# EasyEDA Pro project ProPrj_nrf52833_LighthouseTag_2025-07-26.epro, board PCB18_4
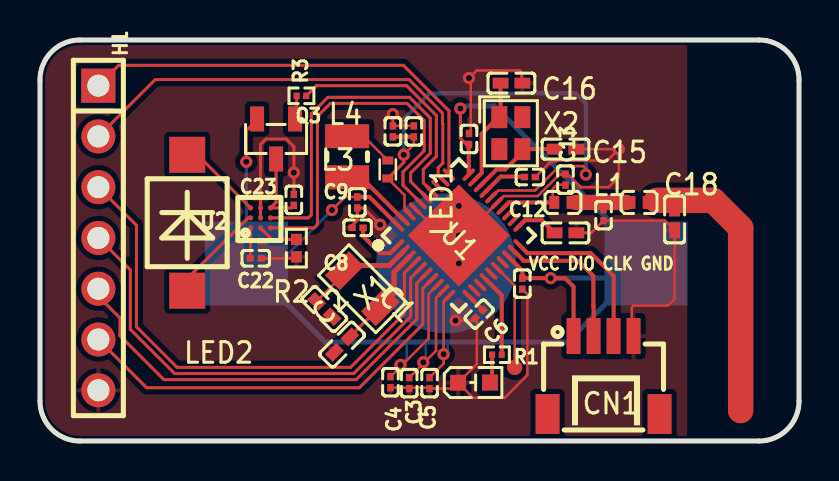
[diagram p13: board, top side]
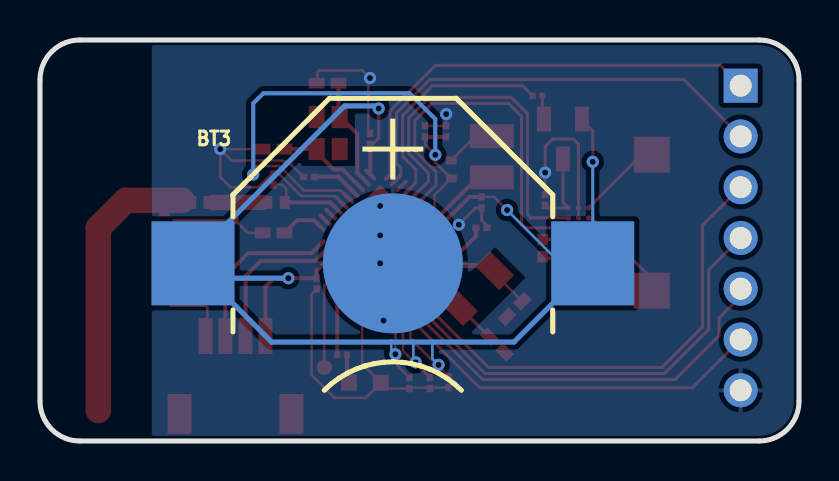
[diagram p14: board, bottom side, seen from below]

Outline 37.97 x 20.07 mm; copper layers: Top Layer, Bottom Layer. Coordinates in mm from the lower left corner of the outline.
Outline path: 0,18.07 arc(0.59,19.48) 2,20.07 35.97,20.07 arc(37.39,19.48) 37.97,18.07 37.97,2 arc(37.39,0.59) 35.97,0 2,0 arc(0.59,0.59) 0,2 0,18.07
Stack: Top Layer 0.035mm / Dielectric1 1.51mm FR4 er 4.5 / Bottom Layer 0.035mm

## Design rules (mm)
template: 用户自定义配置
spacing safeClearance (default): track to track 0.152, other pairs 0.152 to 0.3
track width trackWidth (default): min 0.127, default 0.203, max 1.27
differential pair differentialPair (default): width min 0.127, default 0.254, max 2.54; gap min 0.152, default 0.152
via viaSize (default): diameter min 0.5, default 0.61, max 10; hole min 0.3, default 0.305, max 5.999

## Placement (name value [footprint] x y rotation side)
BT3  MY-1632-03  [BAT-SMD_MY-1632-03]  20.32 8.89 180 bottom
C1  12pF  [C0402]  14.22 6.6 135 top
C2  12pF  [C0402]  15.11 4.83 45 top
C3  4.7uF  [C0201]  18.47 2.9 270 top
C4  4.7uF  [C0201]  17.53 2.94 270 top
C5  4.7uF  [C0201]  19.49 2.9 270 top
C6  4.7uF  [C0201]  21.97 6.35 225 top
C7  100nF  [C0201]  24.13 7.87 90 top
C8  100nF  [C0201]  15.89 10.67 180 top
C9  1uF  [C0201]  15.88 11.94 270 top
C10  820pF  [C0402]  26.29 10.41 0 top
C11  100nF  [C0201]  21.46 15.11 90 top
C12  100nF  [C0201]  24.51 13.21 0 top
C13  1pF  [C0201]  26.29 13.08 90 top
C14  1.2pF  [C0201]  28.19 11.3 90 top
C15  12pF  [C0402]  26.29 14.61 0 top
C16  12pF  [C0402]  23.59 17.91 0 top
C18  12pF  [C0402]  31.75 11.09 90 top
C20  47nF  [C0201]  17.65 15.49 270 top
C21  1uF  [C0201]  18.7 15.49 270 top
C22  1uF  [C0201]  10.8 9.14 0 top
C23  100nF  [C0201]  12.7 12.06 90 top
CN1  1.0-4PWB  [CONN-SMD_4P-P1.00_DEALON_1.0-4PWB]  28.19 3.3 0 top
H1  PZ254V-11-07P  [HDR-TH_7P-P2.54-V-M]  2.92 10.16 270 top
L1  4.7nH  [IND-SMD_L1.0-W0.6]  26.16 11.94 0 top
L2  2.2nH  [IND-SMD_L1.0-W0.6]  29.97 11.94 0 top
L3  15nH  [IND-SMD_L1.0-W0.5-2]  17.4 13.59 270 top
L4  10uH  [IND-SMD_L2.5-W2.0]  15.37 14.22 90 top
LED1  NCD0603G1  [LED0603-RD_1]  21.72 2.92 0 top
LED2  VBPW34S  [SENSOR-SMD_L4.4-W3.9]  7.37 10.92 90 top
NOREF  -  [Pad_e1170]  23.75 3.68 0 top
Q3  HL3407A  [SOT-23-3_L2.9-W1.3-P1.90-LS2.4-BL-1]  11.81 15.11 180 top
R1  10kΩ  [R0201]  22.86 4.32 180 top
R2  15kΩ  [R0402]  12.83 9.65 90 top
R3  1kΩ  [R0201]  13.08 17.27 180 top
U1  nRF52833-QDAA-R  [QFN-40_L5.0-W5.0-P0.40-TL-EP3.6]  20.96 10.29 45 top
U2  -  [TS4231]  11.04 11.17 90 top
X1  32.768kHz  [OSC-SMD_L3.2-W1.5]  16.13 7.62 135 top
X2  32MHz  [CRYSTAL-SMD_4P-L2.0-W1.6-BL-2]  23.56 15.41 270 top

## Footprints (pads in the part's own frame, mm; a bottom-side part is the same pattern mirrored in y, then rotated)
BAT-SMD_MY-1632-03
  rect 4.15x4.2 smd: 1(-10,0) 1(10,0)
  round 7 smd: 2(0,0)
C0201
  rect 0.368x0.324 smd: 1(-0.275,0) 2(0.275,0)
C0402
  rect 0.79x0.54 smd: 1(-0.545,0) 2(0.545,0)
CONN-SMD_4P-P1.00_DEALON_1.0-4PWB
  rect 0.7x1.8 smd: 1(-1.5,1.95) 2(-0.5,1.95) 3(0.5,1.95) 4(1.5,1.95)
  rect 1.2x2 smd: 5(2.8,-1.95) 6(-2.8,-1.95)
CRYSTAL-SMD_4P-L2.0-W1.6-BL-2
  rect 1.1x0.8 smd: 1(-0.8,-0.575) 2(0.8,-0.575) 3(0.8,0.575) 4(-0.8,0.575)
HDR-TH_7P-P2.54-V-M
  rect 1.7x1.7 hole 1.1: 1(-7.62,0)
  round 1.7 hole 1.1: 2(-5.08,0) 3(-2.54,0) 4(0,0) 5(2.54,0) 6(5.08,0) 7(7.62,0)
IND-SMD_L1.0-W0.5-2
  rect 0.4x0.55 smd: 1(-0.45,0) 2(0.45,0)
IND-SMD_L1.0-W0.6
  rect 0.5x0.648 smd: 1(-0.434,0) 2(0.434,0)
IND-SMD_L2.5-W2.0
  rect 1.2x2.2 smd: 1(1.028,0) 2(-1.028,0)
LED0603-RD_1
  rect 0.8x0.8 smd: 1(-0.799,-0.004) 2(0.799,0.004)
OSC-SMD_L3.2-W1.5
  rect 1.05x1.7 smd: 1(-1.275,0) 2(1.275,0)
Pad_e1170
  round 0.762 smd: 1(0,0)
QFN-40_L5.0-W5.0-P0.40-TL-EP3.6
  oval 0.8x0.2 smd: 1(-2.499,1.8) 2(-2.499,1.4) 3(-2.499,1) 4(-2.499,0.6) 5(-2.499,0.2) 6(-2.499,-0.2) 7(-2.499,-0.6) 8(-2.499,-1) 9(-2.499,-1.4) 10(-2.499,-1.8) 21(2.499,-1.8) 22(2.499,-1.4) 23(2.499,-1) 24(2.499,-0.6) 25(2.499,-0.2) 26(2.499,0.2) 27(2.499,0.6) 28(2.499,1) 29(2.499,1.4) 30(2.499,1.8)
  oval 0.2x0.8 smd: 11(-1.8,-2.499) 12(-1.4,-2.499) 13(-1,-2.499) 14(-0.6,-2.499) 15(-0.2,-2.499) 16(0.2,-2.499) 17(0.6,-2.499) 18(1,-2.499) 19(1.4,-2.499) 20(1.8,-2.499) 31(1.8,2.499) 32(1.4,2.499) 33(1,2.499) 34(0.6,2.499) 35(0.2,2.499) 36(-0.2,2.499) 37(-0.6,2.499) 38(-1,2.499) 39(-1.4,2.499) 40(-1.8,2.499)
  rect 3.6x3.6 smd: 41(0,0)
R0201
  rect 0.303x0.324 smd: 1(-0.241,0) 2(0.241,0)
R0402
  rect 0.566x0.54 smd: 1(-0.433,0) 2(0.433,0)
SENSOR-SMD_L4.4-W3.9
  rect 1.8x1.8 smd: 1(-3.4,0) 2(3.4,0)
SOT-23-3_L2.9-W1.3-P1.90-LS2.4-BL-1
  rect 0.7x1.25 smd: 1(-0.95,-1) 2(0.95,-1) 3(0,1)
TS4231
  round 0.262 smd: 1(-0.508,0.508) 2(-0.008,0.508) 3(0.492,0.508) 4(-0.508,0.008) 5(-0.008,0.008) 6(0.492,0.008) 7(-0.508,-0.492) 8(-0.008,-0.492) 9(0.492,-0.492)

## Nets
As in the schematic, except:
RESET: NOREF.1 U1.16

Pads without a net: CN1 5 6; U1 12 13 15 17 22 23 33; X2 2 4

## Via types
v1: diameter 0.61, hole 0.305, Top Layer to Bottom Layer, 18 vias

## Routing (per net, layer and track width the routed paths; a pad name or vN(x,y) marks a point on that pad's centre or on a via; arc(x,y) is an arc through that point)
GND: length 70.6
  Top Layer w0.127: v1(28.96,14.61) 28.39,14.03 25.87,14.03 25.82,13.99 25.57,13.99 C12.2 ; v1(28.96,14.61) C15.2 ; v1(28.96,14.61) 28.96,13.21 28.45,12.7 27.05,12.7 26.4,13.36 C13.2 26.16,13.36 26.13,13.32 25.97,13.32 24.91,12.26 23.21,12.26 U1.25 21.24,10.29 v1(20.96,10.29) 20.11,10.29 U1.37 ; C11.2 21.55,15.47 21.55,18.07 v1(21.46,18.16) 21.84,18.54 24,18.54 24.09,18.45 24.09,17.94 C16.2 ; v1(17.65,16.36) C20.1 18.7,15.77 18.7,15.77 ; C10.2 27.58,10.41 C14.1 31.26,11.03 C18.1 31.75,7.11 31.41,6.78 29.69,6.78 29.6,6.69 29.6,5.34 CN1.4 ; LED1.1 21.86,3.86 21.86,6.08 21.78,6.16 21.65,6.03 v1(20.79,6.03) ; LED1.1 21.68,2.16 23.24,2.16 24.38,3.3 24.38,7.35 C7.1 ; LED1.1 20.62,2.62 19.49,2.62 19.44,2.67 C4.2
  Top Layer w0.152: R2.1 12.75,9.14 C22.2 ; v1(17.02,10.82) 16.18,11.66 C9.2 15.88,11.05 15.56,10.73 C8.2 ; C23.2 v1(12.7,13.43) 12.7,14.73 12.32,15.11 11.3,15.11 11.03,14.84 U2.6 U2.5
  vias: v1(20.96,11.76) v1(20.96,8.89)
VDD_NRF: length 85.4
  Top Layer w0.127: U1.9 19.81,7.16 19.81,4.51 C3.1 ; C5.1 20.19,3.88 v1(20.19,4.34) 20.19,6.98 20.46,7.25 ; C4.1 19.44,5.13 19.44,7.36 U1.8 ; C9.1 15.26,12.21 v1(14.61,11.56)
  Top Layer w0.152: v1(10.32,13.97) 10.32,15.53 10.86,16.07 Q3.2 ; 21.45,14.83 21.4,14.78 21.03,15.15 v1(21.03,16.64)
  Top Layer w0.203: C9.1 16.48,12.21 U1.40 ; 23.43,9.23 24.13,8.53 C7.2 v1(25.55,8.15) 26.27,8.15 26.69,7.72 CN1.1 ; U1.30 21.45,14.83 C11.1
  Bottom Layer w0.127: v1(19.18,3.94) 19.3,4.06 19.3,4.95 ; v1(14.61,11.56) 11.94,8.89 BT3.1 ; 20.4,4.95 20.4,4.55 v1(20.19,4.34) ; v1(18.03,3.81) 18.34,4.12 18.34,4.95
  Bottom Layer w0.152: BT3.1 v1(10.32,13.97)
  Bottom Layer w0.254: 29.58,8.15 26.38,4.95 14.26,4.95 BT3.1 ; 29.58,8.15 BT3.1 30.32,9.18 22.73,16.76 21.16,16.76 v1(21.03,16.64) ; 29.58,8.15 v1(25.55,8.15)
D/CFGDATA: length 18.7
  Top Layer w0.152: U1.36 18.16,12.8 18.16,13.46 19.22,14.52 19.22,16.03 18.37,16.89 14.53,16.89 13.88,16.25 13.88,10.83 13.71,10.66 U2.7
DCC: length 3.1
  Top Layer w0.203: U1.39 16.32,12.94 15.88,12.94
DEC4: length 26.8
  Top Layer w0.127: 22.58,12.2 22.92,12.53 24.76,12.53 25.98,13.76 27.18,13.76 27.31,13.63 v1(27.31,13.33) ; C21.2 18.7,14.83 v1(18.2,14.32) ; U1.38 18.48,11.47 18.24,11.71 18.24,12.3 L3.2
  Top Layer w0.152: L3.2 18.2,13.94 v1(18.2,14.32)
  Top Layer w0.203: C20.2 18.7,15.22
  Bottom Layer w0.203: v1(18.2,14.32) 18.2,16.11 19.49,17.4 26.8,17.4 27.31,16.89 v1(27.31,13.33)
E/CFGCLK: length 18.6
  Top Layer w0.152: U2.8 13.43,11.16 13.58,11.32 13.58,16.37 14.4,17.2 18.49,17.2 19.53,16.16 19.53,14.4 18.54,13.41 18.54,12.98 U1.35
LED: length 4.1
  Top Layer w0.203: U1.14 23.1,7.29 R1.1
POWER_TS4231: length 11.6
  Top Layer w0.152: R3.1 13.83,17.78 18.34,17.78 19.83,16.29 19.83,14.24 19.18,13.59 19.18,12.91 U1.34
PWM1: length 22.1
  Top Layer w0.152: U1.31 20.46,16.52 18.18,18.8 3.94,18.8 H1.1
PWM2: length 22.7
  Top Layer w0.152: U1.32 19.92,13.3 19.92,13.68 20.15,13.91 20.15,15.87 20.14,15.89 20.14,16.41 18.46,18.08 5.77,18.08 H1.2
PWM3: length 25.9
  Top Layer w0.152: H1.3 4.83,10.8 4.83,5.72 6.86,3.68 15.53,3.68 18.23,6.38 18.23,8.41 U1.4
PWM4: length 24
  Top Layer w0.152: H1.4 4.52,8.56 4.52,5.59 6.73,3.38 15.7,3.38 18.54,6.22 18.54,8.16 19.05,8.66
PWM5: length 22.3
  Top Layer w0.152: H1.5 2.92,7.24 4,6.16 4,5.27 6.2,3.07 15.82,3.07 18.85,6.1 18.85,7.9 U1.6
PWM6: length 21
  Top Layer w0.152: U1.7 19.15,7.64 19.15,5.84 15.98,2.67 5.33,2.67 H1.6
RESET: length 5.4
  Top Layer w0.127: 22.86,8.66 23.75,7.78 23.75,3.81 23.62,3.68
SWDCLK: length 8.4
  Top Layer w0.203: CN1.3 28.7,5.26 28.7,8.25 27.56,9.4 24.39,9.4 24,9.79
SWDIO: length 7.5
  Top Layer w0.203: CN1.2 27.69,6.78 27.69,6.78 27.69,8.25 26.92,9.02 24.21,9.02 U1.19
XC1: length 4.6
  Top Layer w0.203: C15.1 X2.3 24.2,14.53 24.2,14.52 23.27,13.59 22.84,13.59 22.02,12.76
XC2: length 5.4
  Top Layer w0.203: C16.1 23.04,16.27 X2.1 22.94,16.2 22.1,15.37 22.1,13.41 U1.29
XL1: length 4.9
  Top Layer w0.127: 14.97,8.4 14.97,8.12 C1.2
  Top Layer w0.254: 15.48,8.78 17.47,8.78 U1.2
XL2: length 4.9
  Top Layer w0.152: X1.1 17.01,6.72 C2.2
  Top Layer w0.254: 17.28,6.98 17.71,7.41 17.71,8.45 18.49,9.22
$1N2289: length 2.1
  Top Layer w0.203: C10.1 25.11,11.05 24.26,11.05 24,10.78
$1N2530: length 3.9
  Top Layer w0.127: 25.65,12.19 25.65,12.61 25.87,12.83 26.27,12.83 C13.1
  Top Layer w0.203: L1.1 23.45,11.94 U1.24
$1N2985: length 2.5
  Top Layer w0.762: 26.8,11.94 29.34,11.94
$1N3242: length 13.9
  Top Layer w1.27: 30.86,12.04 33.68,12.04 35.05,10.67 35.05,1.52
$1N3495: length 2.2
  Top Layer w0.203: U1.27 22.31,12.49 arc(22.32,12.5) 22.33,12.51 23.06,13.23 24.21,13.23
$1N6091: length 2.5
  Top Layer w0.127: L4.1 16.19,15.25 L3.1
$1N9430: length 1.5
  Top Layer w0.152: U2.1 10.53,9.16 C22.1
$1N11204: length 4.3
  Top Layer w0.152: U2.3 7.88,14.32 LED2.2
$1N11226: length 5
  Top Layer w0.152: U2.2 10.41,11.16 7.37,8.12 LED2.1
$1N11357: length 2
  Top Layer w0.152: 12.83,10.08 11.61,10.08 11.39,10.31 11.38,10.31 11.17,10.52 11.17,10.52 U2.4
$1N22902: length 1.2
  Top Layer w0.203: R1.2 22.62,3.1 22.6,3.09
$1N23087: length 2.7
  Top Layer w0.203: U1.1 17.52,9.4 17.02,9.4 16.16,10.25 C8.1
$1N28962: length 3.8
  Top Layer w0.152: Q3.3 11.81,11.94 U2.9 12.57,11.66 C23.1
$1N29852: length 1
  Top Layer w0.203: 21.45,7.25 21.46,7.25 C6.1
$1N31595: length 1.2
  Top Layer w0.152: R3.2 12.84,16.19 12.76,16.11

## Copper pours and planes (outline as drawn; the poured copper is in the pictures)
GND on Top Layer: -3.17,22.86 -3.17,-5.97 -3.3,-6.1 36.7,-6.1 45.97,3.17 45.97,27.31 38.99,34.29 27.56,22.86
GND on Top Layer: 5.1,16.14 5.33,16.15 9.76,16.15 9.78,16.13 9.78,14.47 12.06,12.19 12.06,10.03 9.53,7.5 9.53,5.72 5.1,5.72
GND on Bottom Layer: -6.6,27.94 44.83,27.94 44.83,-4.7 -6.6,-4.7

## Text on the board
Top Silkscreen Layer: VCC DIO CLK GND
